# Altium project PCB_tesis.PrjPcb
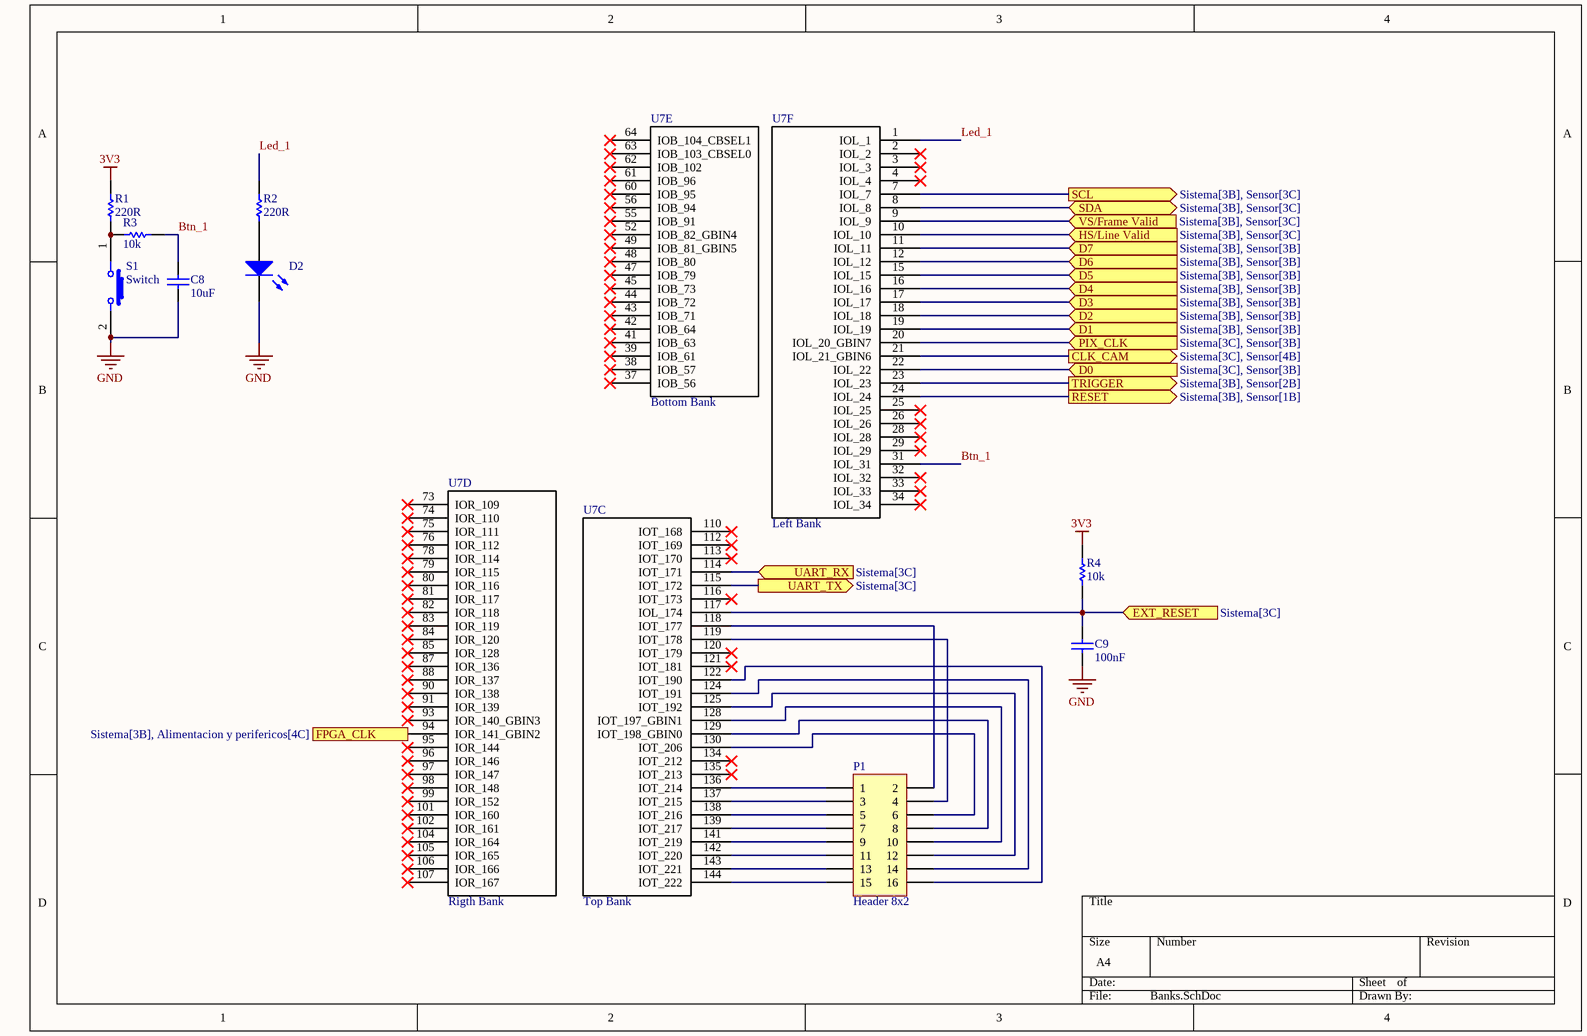
[diagram p0: Banks.SchDoc]
3 sheets, 42 parts. Net scope: flat (ports and power ports of the same name join across sheets).
Board file: Sistema.PcbDoc
Sheets:
  Banks.SchDoc
  Sensor.SchDoc
  Power.SchDoc

## Sheet Banks.SchDoc
size A4; SheetNumber: 3; SheetTotal: 5

### Parts
C8  10uF  [C_1206_3216_A]
C9  100nF  [C_0805_2013_b]
D2  GREEN  [D_LED_0805_2013]  (value not drawn)
P1  Header 8x2  [P_HDR2X8_3D]
R1  220R  [R_0805_2012_a]
R2  220R  [R_0805_2012_a]
R3  10k  [R_0805_2012_a]
R4  10k  [R_0805_2012_a]
S1  Switch  [S_SMD_SPST-NO]
U7  Top Bank  [U_TQFP-144]  (parts C,D,E,F of 9)

### Ports
CLK_CAM (out, see Sistema[3C], Sensor[4B]), D0 (in, see Sistema[3C], Sensor[3B]), D1 (in, see Sistema[3B], Sensor[3B]), D2 (in, see Sistema[3B], Sensor[3B]), D3 (in, see Sistema[3B], Sensor[3B]), D4 (in, see Sistema[3B], Sensor[3B]), D5 (in, see Sistema[3B], Sensor[3B]), D6 (in, see Sistema[3B], Sensor[3B]), D7 (in, see Sistema[3B], Sensor[3B]), EXT_RESET (in, see Sistema[3C]), FPGA_CLK (in, see Sistema[3B], Alimentacion y perifericos[4C]), HS/Line Valid (in, see Sistema[3B], Sensor[3C]), PIX_CLK (in, see Sistema[3C], Sensor[3B]), RESET (out, see Sistema[3B], Sensor[1B]), SCL (out, see Sistema[3B], Sensor[3C]), SDA (bidir, see Sistema[3B], Sensor[3C]), TRIGGER (out, see Sistema[3B], Sensor[2B]), UART_RX (in, see Sistema[3C]), UART_TX (out, see Sistema[3C]), VS/Frame Valid (in, see Sistema[3B], Sensor[3C])

### Nets
3V3: R1.2 R4.2
GND: C8.1 C9.1 D2.1(K) S1.2
Btn_1: C8.2 R3.2 U7.31(IOL_31)
Led_1: R2.2 U7.1(IOL_1)
NetC9_2: C9.2 R4.1 U7.117(IOL_174) ; port EXT_RESET
NetC45_2: U7.24(IOL_24) ; port RESET
NetD2_2: D2.2(A) R2.1
NetP1_1: P1.1 U7.136(IOT_214)
NetP1_2: P1.2 U7.118(IOT_177)
NetP1_3: P1.3 U7.137(IOT_215)
NetP1_4: P1.4 U7.119(IOT_178)
NetP1_5: P1.5 U7.138(IOT_216)
NetP1_6: P1.6 U7.130(IOT_206)
NetP1_7: P1.7 U7.139(IOT_217)
NetP1_8: P1.8 U7.129(IOT_198_GBIN0)
NetP1_9: P1.9 U7.141(IOT_219)
NetP1_10: P1.10 U7.128(IOT_197_GBIN1)
NetP1_11: P1.11 U7.142(IOT_220)
NetP1_12: P1.12 U7.125(IOT_192)
NetP1_13: P1.13 U7.143(IOT_221)
NetP1_14: P1.14 U7.124(IOT_191)
NetP1_15: P1.15 U7.144(IOT_222)
NetP1_16: P1.16 U7.122(IOT_190)
NetR1_1: R1.1 R3.1 S1.1
NetR13_2: U7.21(IOL_21_GBIN6) ; port CLK_CAM
NetR16_1: U7.7(IOL_7) ; port SCL
NetR17_1: U7.8(IOL_8) ; port SDA
NetU7_9: U7.9(IOL_9) ; port VS/Frame Valid
NetU7_10: U7.10(IOL_10) ; port HS/Line Valid
NetU7_11: U7.11(IOL_11) ; port D7
NetU7_12: U7.12(IOL_12) ; port D6
NetU7_15: U7.15(IOL_15) ; port D5
NetU7_16: U7.16(IOL_16) ; port D4
NetU7_17: U7.17(IOL_17) ; port D3
NetU7_18: U7.18(IOL_18) ; port D2
NetU7_19: U7.19(IOL_19) ; port D1
NetU7_20: U7.20(IOL_20_GBIN7) ; port PIX_CLK
NetU7_22: U7.22(IOL_22) ; port D0
NetU7_23: U7.23(IOL_23) ; port TRIGGER
NetU7_94: U7.94(IOR_141_GBIN2) ; port FPGA_CLK
NetU7_114: U7.114(IOT_171) ; port UART_RX
NetU7_115: U7.115(IOT_172) ; port UART_TX

Not connected (* = marked no-connect by the designer): U7 2(IOL_2)* 3(IOL_3)* 4(IOL_4)* 25(IOL_25)* 26(IOL_26)* 28(IOL_28)* 29(IOL_29)* 32(IOL_32)* 33(IOL_33)* 34(IOL_34)* 37(IOB_56)* 38(IOB_57)* 39(IOB_61)* 41(IOB_63)* 42(IOB_64)* 43(IOB_71)* 44(IOB_72)* 45(IOB_73)* 47(IOB_79)* 48(IOB_80)* 49(IOB_81_GBIN5)* 52(IOB_82_GBIN4)* 55(IOB_91)* 56(IOB_94)* 60(IOB_95)* 61(IOB_96)* 62(IOB_102)* 63(IOB_103_CBSEL0)* 64(IOB_104_CBSEL1)* 73(IOR_109)* 74(IOR_110)* 75(IOR_111)* 76(IOR_112)* 78(IOR_114)* 79(IOR_115)* 80(IOR_116)* 81(IOR_117)* 82(IOR_118)* 83(IOR_119)* 84(IOR_120)* 85(IOR_128)* 87(IOR_136)* 88(IOR_137)* 90(IOR_138)* 91(IOR_139)* 93(IOR_140_GBIN3)* 95(IOR_144)* 96(IOR_146)* 97(IOR_147)* 98(IOR_148)* 99(IOR_152)* 101(IOR_160)* 102(IOR_161)* 104(IOR_164)* 105(IOR_165)* 106(IOR_166)* 107(IOR_167)* 110(IOT_168)* 112(IOT_169)* 113(IOT_170)* 116(IOT_173)* 120(IOT_179)* 121(IOT_181)* 134(IOT_212)* 135(IOT_213)*

### Library data of the parts
C8 = C_10uF_25V_c: Capacitor SMD 1206; Manufacturer: Samsung; Manufacturer Part Number: CL31B106KAHNFNE; Tolerance: 10%; Voltage Rating: 25V; Dielectric: X7R; Mounting Technology: Surface Mount; Case/Package: 1206; Case Code (Metric): 3216; Case Code (Imperial): 1206; Min Operating Temperature: -55°C; Max Operating Temperature: 125°C; Packaging: Tape and Reel; Series: CL; Construction: Flat; Length: 3.2mm; Height: 1.6mm; Depth: 1.6mm; Radiation Hardening: No; Lead Free: Lead Free; RoHS Compliant: Yes; ComponentLink1URL: https://datasheet.ciiva.com/25795/cl31b106kahnfne-25795136.pdf?src-supplier=Digikey; ComponentLink1Description: https://datasheet.ciiva.com/25795/cl31b106kahnfne-25795136.pdf?src-supplier=Digikey; Supplier 1: Digikey; Supplier Part Number 1: 1276-3100-1-ND; RoHS: Yes; Category: Ceramic Capacitors; Stock 1: 466532; Pricing 1: 1=0,23, 10=0,149, 50=0,094, 100=0,0752, 500=0,0543, 1000=0,04804 (USD); Value: 10uF
C9 = C_100nF_50V_b: Capacitor SMD 0805; Manufacturer: Yageo; Manufacturer Part Number: CC0805KRX7R9BB104; Material: Ceramic; Tolerance: 10%; Dielectric: X7R; Voltage: 50V; Insulation Resistance: 100GR; Mounting Technology: Surface Mount; Case/Package: 0805; Pins: 2; Case Code (Metric): 2012; Case Code (Imperial): 0805; Min Operating Temperature: -55°C; Max Operating Temperature: 125°C; Packaging: Tape and Reel; Voltage Rating: 50V; Package Quantity: 4000; Termination: SMD/SMT; Series: CC; Length: 2mm; Height: 0.85mm; Depth: 1.25mm; Radiation Hardening: No; RoHS Compliant: Yes; Reach SVHC Compliant: No; Halogen Free: 5694HalogenFree; Lead Free: 5697LeadFree; ComponentLink1URL: https://datasheet.ciiva.com/11786/0900766b80d84f1d-11786009.pdf?src-supplier=Rs; ComponentLink1Description: https://datasheet.ciiva.com/11786/0900766b80d84f1d-11786009.pdf?src-supplier=Rs; ComponentLink2URL: https://datasheet.ciiva.com/46393/1734573-46393307.pdf?src-supplier=Element14; ComponentLink2Description: https://datasheet.ciiva.com/46393/1734573-46393307.pdf?src-supplier=Element14; ComponentLink3URL: https://datasheet.ciiva.com/155/mlccorderingcode-155930.pdf?src-supplier=Digikey; ComponentLink3Description: https://datasheet.ciiva.com/155/mlccorderingcode-155930.pdf?src-supplier=Digikey; ComponentLink4URL: https://datasheet.ciiva.com/155/mlccorderingcode-155929.pdf?src-supplier=Digikey; ComponentLink4Description: https://datasheet.ciiva.com/155/mlccorderingcode-155929.pdf?src-supplier=Digikey; ComponentLink5URL: https://datasheet.ciiva.com/155/mlccorderingcode-155931.pdf?src-supplier=Digikey; ComponentLink5Description: https://datasheet.ciiva.com/155/mlccorderingcode-155931.pdf?src-supplier=Digikey; ComponentLink6URL: https://datasheet.ciiva.com/11464/upy-gphc-x7r-6-3v-to-50v-8-11464757.pdf?src-supplier=Avnet; ComponentLink6Description: https://datasheet.ciiva.com/11464/upy-gphc-x7r-6-3v-to-50v-8-11464757.pdf?src-supplier=Avnet; ComponentLink7URL: https://datasheet.ciiva.com/28450/1489800-28450805.pdf?src-supplier=Element14; ComponentLink7Description: https://datasheet.ciiva.com/28450/1489800-28450805.pdf?src-supplier=Element14; ComponentLink8URL: https://datasheet.ciiva.com/29242/445210-da-01-en-kerko-chip-0805-x7r-0-1uf-10proz-50vg-29242074.pdf?src-supplier=Conrad; ComponentLink8Description: https://datasheet.ciiva.com/29242/445210-da-01-en-kerko-chip-0805-x7r-0-1uf-10proz-50vg-29242074.pdf?src-supplier=Conrad; Supplier 1: Digikey; Supplier Part Number 1: 311-1140-1-ND; RoHS: Yes; Category: Ceramic Capacitors; Stock 1: 5306374; Pricing 1: 1=0,1, 10=0,07, 50=0,0418, 100=0,0329, 500=0,02428, 1000=0,0201 (USD); Value: 100nF
D2 = D_LED_SMD_0805: (Modificar) Diode SMD 0805; Value: GREEN
P1 = P_Conector 8x2: Value: Header 8x2
R1 R2 = R_220R_b: Resistor SMD 0805; Manufacturer: Bourns; Manufacturer Part Number: CR0805-FX-2200ELF; Tolerance: 1%; Power Rating: 125mW; Voltage Rating: 150V; Temperature Coefficient: 100ppm/°C; Mounting Technology: Surface Mount; Case/Package: 0805; Case Code (Metric): 2012; Case Code (Imperial): 0805; Contact Plating: Tin; Min Operating Temperature: -55°C; Max Operating Temperature: 155°C; Package Quantity: 5000; Packaging: Tape and Reel; Number of Terminations: 2; Termination: SMD/SMT; Max Power Dissipation: 125mW; Features: Moisture Resistant; Series: CR0805; Length: 2mm; Width: 1.25mm; Height: 0.5mm; Thickness: 508um; Radiation Hardening: No; RoHS Compliant: Yes; ComponentLink1URL: https://datasheet.ciiva.com/5540/chpreztr-5540846.pdf?src-supplier=Mouser; ComponentLink1Description: https://datasheet.ciiva.com/5540/chpreztr-5540846.pdf?src-supplier=Mouser; Supplier 1: Digikey; Supplier Part Number 1: CR0805-FX-2200ELFCT-ND; RoHS: Yes; Category: Chip SMD Resistors; Stock 1: 162372; Pricing 1: 1=0,1, 10=0,021, 50=0,0132, 100=0,011, 500=0,00744, 1000=0,00639 (USD); Value: 220R
R3 R4 = R_10k_b: Resistor SMD 0805; Manufacturer: Yageo; Manufacturer Part Number: AC0805FR-0710KL; Tolerance: 1%; Power Rating: 125mW; Voltage Rating: 150V; Temperature Coefficient: 100ppm/°C; Case/Package: 0805; Case Code (Metric): 2012; Case Code (Imperial): 0805; Min Operating Temperature: -55°C; Max Operating Temperature: 155°C; Packaging: Tape and Reel; Package Quantity: 1; Number of Terminations: 2; Termination: SMD/SMT; Max Power Dissipation: 125mW; Features: Moisture Resistant,Automotive AEC-Q200,Anti-Sulfur; Series: AC; Construction: Rectangular; Length: 0.079inch; Width: 0.049inch; Height: 0.024inch; Depth: 1.25mm; Military Standard: Not; Lead Free: Lead Free; RoHS Compliant: Yes; ComponentLink1URL: http://www.yageo.com/NewPortal/yageodocoutput?fileName=/pdf/R-Chip/PYu-AC_51_RoHS_L_6.pdf&src-supplier=Digikey; ComponentLink1Description: http://www.yageo.com/NewPortal/yageodocoutput?fileName=/pdf/R-Chip/PYu-AC_51_RoHS_L_6.pdf&src-supplier=Digikey; ComponentLink2URL: http://www.yageo.com/documents/recent/PYu-AC_51_RoHS_L_2_revised.pdf?src-supplier=Future+Electronics; ComponentLink2Description: http://www.yageo.com/documents/recent/PYu-AC_51_RoHS_L_2_revised.pdf?src-supplier=Future+Electronics; ComponentLink3URL: http://www.yageo.com/NewPortal/yageodocoutput?fileName=/pdf/R-Chip/PYu-AC_51_RoHS_L_6.pdf&src-supplier=NAC+Semi; ComponentLink3Description: http://www.yageo.com/NewPortal/yageodocoutput?fileName=/pdf/R-Chip/PYu-AC_51_RoHS_L_6.pdf&src-supplier=NAC+Semi; ComponentLink4URL: http://www.yageo.com/NewPortal/yageodocoutput?fileName=/pdf/R-Chip/PYu-AC_51_RoHS_L_6.pdf&src-supplier=Rutronik; ComponentLink4Description: http://www.yageo.com/NewPortal/yageodocoutput?fileName=/pdf/R-Chip/PYu-AC_51_RoHS_L_6.pdf&src-supplier=Rutronik; Supplier 1: Digikey; Supplier Part Number 1: 311-10KLGCT-ND; RoHS: Yes; Category: Chip SMD Resistors; Stock 1: 480247; Pricing 1: 1=0,1, 10=0,031, 50=0,0198, 100=0,0166, 500=0,01152, 1000=0,00997 (USD); Value: 10k
S1 = S_?_3: (Generico) Switch SMD; Value: Switch
U7 = U_iCE40HX4K: Supplier 1: Digikey; Supplier Part Number 1: 220-1572-ND

## Sheet Sensor.SchDoc
size A4; SheetNumber: 5; SheetTotal: 5
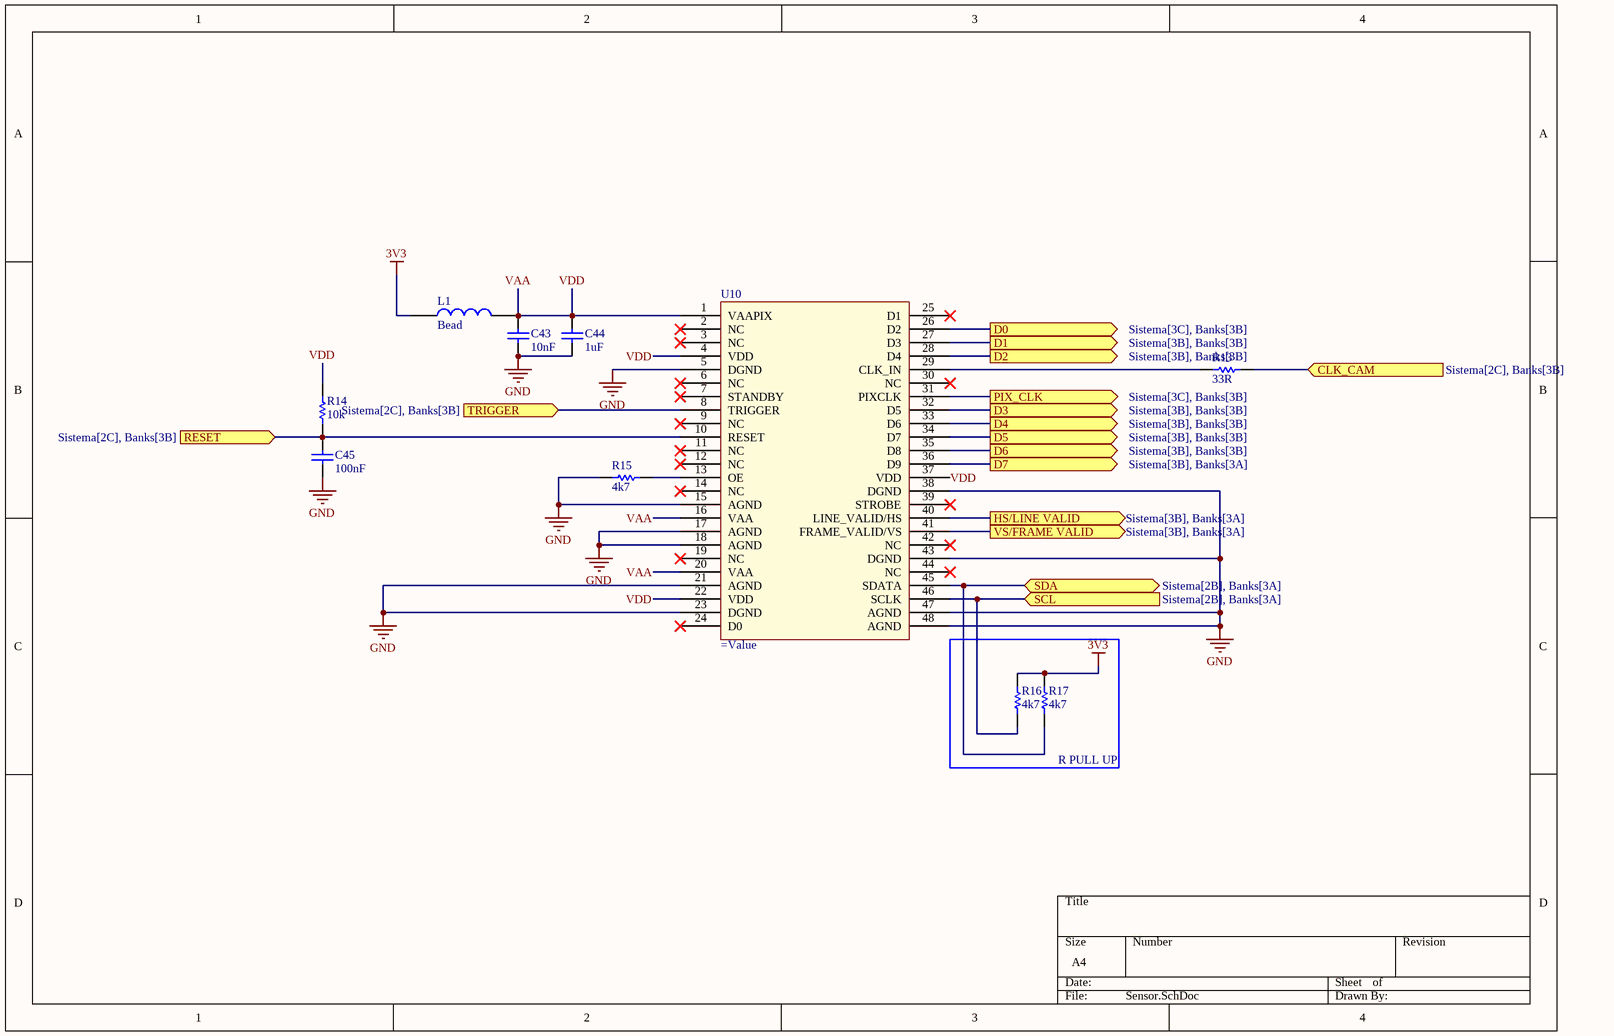
[diagram p1: Sensor.SchDoc]

### Parts
C43  10nF  [C_0805_2013_b]
C44  1uF  [C_0805_2013_b]
C45  100nF  [C_0805_2013_b]
L1  Bead  [L_0805_2013]
R13  33R  [R_0805_2012_a]
R14  10k  [R_0805_2012_a]
R15  4k7  [R_0805_2012_a]
R16  4k7  [R_0805_2012_a]
R17  4k7  [R_0805_2012_a]
U10  (no value)  [U_CLCC48_SOCKET]

### Blocks framed on the sheet
R PULL UP: R16 R17

### Ports
CLK_CAM (in, see Sistema[2C], Banks[3B]), D0 (out, see Sistema[3C], Banks[3B]), D1 (out, see Sistema[3B], Banks[3B]), D2 (out, see Sistema[3B], Banks[3B]), D3 (out, see Sistema[3B], Banks[3B]), D4 (out, see Sistema[3B], Banks[3B]), D5 (out, see Sistema[3B], Banks[3B]), D6 (out, see Sistema[3B], Banks[3B]), D7 (out, see Sistema[3B], Banks[3A]), HS/LINE VALID (out, see Sistema[3B], Banks[3A]), PIX_CLK (out, see Sistema[3C], Banks[3B]), RESET (in, see Sistema[2C], Banks[3B]), SCL (in, see Sistema[2B], Banks[3A]), SDA (bidir, see Sistema[2B], Banks[3A]), TRIGGER (in, see Sistema[2C], Banks[3B]), VS/FRAME VALID (out, see Sistema[3B], Banks[3A])

### Nets
3V3: L1.1 R16.2 R17.2
GND: C43.1 C44.1 C45.1 R15.1 U10.5(DGND) U10.15(AGND) U10.17(AGND) U10.18(AGND) U10.21(AGND) U10.23(DGND) U10.38(DGND) U10.43(DGND) U10.47(AGND) U10.48(AGND)
VAA: C43.2 C44.2 L1.2 R14.2 U10.1(VAAPIX) U10.4(VDD) U10.16(VAA) U10.20(VAA) U10.22(VDD) U10.37(VDD)  [also labelled VDD]
NetC45_2: C45.2 R14.1 U10.10(RESET) ; port RESET
NetR13_1: R13.1 U10.29(CLK_IN)
NetR13_2: R13.2 ; port CLK_CAM
NetR15_2: R15.2 U10.13(OE)
NetR16_1: R16.1 U10.46(SCLK) ; port SCL
NetR17_1: R17.1 U10.45(SDATA) ; port SDA
NetU7_9: U10.41(FRAME_VALID/VS) ; port VS/FRAME VALID
NetU7_10: U10.40(LINE_VALID/HS) ; port HS/LINE VALID
NetU7_11: U10.36(D9) ; port D7
NetU7_12: U10.35(D8) ; port D6
NetU7_15: U10.34(D7) ; port D5
NetU7_16: U10.33(D6) ; port D4
NetU7_17: U10.32(D5) ; port D3
NetU7_18: U10.28(D4) ; port D2
NetU7_19: U10.27(D3) ; port D1
NetU7_20: U10.31(PIXCLK) ; port PIX_CLK
NetU7_22: U10.26(D2) ; port D0
NetU7_23: U10.8(TRIGGER) ; port TRIGGER

Not connected (* = marked no-connect by the designer): U10 2(NC)* 3(NC)* 6(NC)* 7(STANDBY)* 9(NC)* 11(NC)* 12(NC)* 14(NC)* 19(NC)* 24(D0)* 25(D1)* 30(NC)* 39(STROBE)* 42(NC)* 44(NC)*

### Library data of the parts
C43 = C_10nF_50V_b: Capacitor SMD 0805; Manufacturer: KEMET; Manufacturer Part Number: C0805C103J5RAC7210; Dielectric Material: Ceramic; Tolerance: 5%; Voltage Rating: 50V; Dielectric: X7R; Case/Package: 0805; Case Code (Imperial): 0805; Case Code (Metric): 2012; Min Operating Temperature: -55°C; Max Operating Temperature: 125°C; Packaging: Tape and Reel; Package Quantity: 10000; Voltage Rating (DC): 50V; Termination: SMD/SMT; Series: SMD Comm X7R; Length: 2mm; Lead Pitch: 0.75mm; Depth: 1.25mm; RoHS Compliant: Yes; ComponentLink1URL: http://www.mouser.com/ds/2/212/KEM_C1002_X7R_SMD-1102033.pdf?src-supplier=Mouser; ComponentLink1Description: http://www.mouser.com/ds/2/212/KEM_C1002_X7R_SMD-1102033.pdf?src-supplier=Mouser; ComponentLink2URL: http://components.arrow.com/part/dataview/3450688S9650973N7429?src-supplier=Arrow+Electronics; ComponentLink2Description: http://components.arrow.com/part/dataview/3450688S9650973N7429?src-supplier=Arrow+Electronics; ComponentLink3URL: https://datasheet.octopart.com/C0805C103J5RAC7210-KEMET-datasheet-68331906.pdf?src-supplier=Farnell; ComponentLink3Description: https://datasheet.octopart.com/C0805C103J5RAC7210-KEMET-datasheet-68331906.pdf?src-supplier=Farnell; ComponentLink4URL: https://api.kemet.com/component-edge/download/datasheet/C0805C103J5RAC7210.pdf?src-supplier=Digikey; ComponentLink4Description: https://api.kemet.com/component-edge/download/datasheet/C0805C103J5RAC7210.pdf?src-supplier=Digikey; ComponentLink5URL: https://datasheet.octopart.com/C0805C103J5RAC7210-KEMET-datasheet-37550250.pdf?src-supplier=Electro+Sonic; ComponentLink5Description: https://datasheet.octopart.com/C0805C103J5RAC7210-KEMET-datasheet-37550250.pdf?src-supplier=Electro+Sonic; ComponentLink6URL: https://datasheet.octopart.com/C0805C103J5RAC7210-KEMET-datasheet-166547538.pdf?src-supplier=TME; ComponentLink6Description: https://datasheet.octopart.com/C0805C103J5RAC7210-KEMET-datasheet-166547538.pdf?src-supplier=TME; Supplier 1: Mouser; Supplier Part Number 1: 80-C0805C103J5R7210; RoHS: Yes; Category: Ceramic Capacitors; Stock 1: 30128; Pricing 1: 1=0,1, 10=0,034, 50=0,034, 100=0,02, 1000=0,014, 10000=0,009 (USD); Value: 10nF
C44 = C_1uF_50V_b: Capacitor SMD 0805; Manufacturer: Cal-Chip Electronics; Manufacturer Part Number: GMC21X7R105K50NT; Supplier 1: Digikey; Supplier Part Number 1: 4713-GMC21X7R105K50NTCT-ND; RoHS: Yes; Category: Ceramic Capacitors; Stock 1: 1410; Pricing 1: 1=0,16, 10=0,106, 50=0,0632, 100=0,0497, 500=0,03672, 1000=0,0304 (USD); Value: 1uF; JLCPCB Part #: C17287262
C45 = C_100nF_50V_b: as C9 on sheet Banks; Mounting Technology: Surface Mount; Case/Package: 0805; Pins: 2; Case Code (Metric): 2012; Case Code (Imperial): 0805; Min Operating Temperature: -55°C; Max Operating Temperature: 125°C; Packaging: Tape and Reel; Voltage Rating: 50V; Package Quantity: 4000; Termination: SMD/SMT; Series: CC; Length: 2mm; Height: 0.85mm; Depth: 1.25mm; Radiation Hardening: No; RoHS Compliant: Yes; Reach SVHC Compliant: No; Halogen Free: 5694HalogenFree; Lead Free: 5697LeadFree; ComponentLink1URL: https://datasheet.ciiva.com/11786/0900766b80d84f1d-11786009.pdf?src-supplier=Rs; ComponentLink1Description: https://datasheet.ciiva.com/11786/0900766b80d84f1d-11786009.pdf?src-supplier=Rs; ComponentLink2URL: https://datasheet.ciiva.com/46393/1734573-46393307.pdf?src-supplier=Element14; ComponentLink2Description: https://datasheet.ciiva.com/46393/1734573-46393307.pdf?src-supplier=Element14; ComponentLink3URL: https://datasheet.ciiva.com/155/mlccorderingcode-155930.pdf?src-supplier=Digikey; ComponentLink3Description: https://datasheet.ciiva.com/155/mlccorderingcode-155930.pdf?src-supplier=Digikey; ComponentLink4URL: https://datasheet.ciiva.com/155/mlccorderingcode-155929.pdf?src-supplier=Digikey; ComponentLink4Description: https://datasheet.ciiva.com/155/mlccorderingcode-155929.pdf?src-supplier=Digikey; ComponentLink5URL: https://datasheet.ciiva.com/155/mlccorderingcode-155931.pdf?src-supplier=Digikey; ComponentLink5Description: https://datasheet.ciiva.com/155/mlccorderingcode-155931.pdf?src-supplier=Digikey; ComponentLink6URL: https://datasheet.ciiva.com/11464/upy-gphc-x7r-6-3v-to-50v-8-11464757.pdf?src-supplier=Avnet; ComponentLink6Description: https://datasheet.ciiva.com/11464/upy-gphc-x7r-6-3v-to-50v-8-11464757.pdf?src-supplier=Avnet; ComponentLink7URL: https://datasheet.ciiva.com/28450/1489800-28450805.pdf?src-supplier=Element14; ComponentLink7Description: https://datasheet.ciiva.com/28450/1489800-28450805.pdf?src-supplier=Element14; ComponentLink8URL: https://datasheet.ciiva.com/29242/445210-da-01-en-kerko-chip-0805-x7r-0-1uf-10proz-50vg-29242074.pdf?src-supplier=Conrad; ComponentLink8Description: https://datasheet.ciiva.com/29242/445210-da-01-en-kerko-chip-0805-x7r-0-1uf-10proz-50vg-29242074.pdf?src-supplier=Conrad; Supplier 1: Digikey; Supplier Part Number 1: 311-1140-1-ND; RoHS: Yes; Category: Ceramic Capacitors; Stock 1: 5306374; Pricing 1: 1=0,1, 10=0,07, 50=0,0418, 100=0,0329, 500=0,02428, 1000=0,0201 (USD); Value: 100nF
L1 = L_Bead: Inductor SMD 0805; Manufacturer: Pulse; Manufacturer Part Number: PE-0805PFB600ST; Number of Lines: 1; Max Current Rating: 3A; Mounting Technology: Surface Mount; Case/Package: 0805; Case Code (Metric): 2012; Case Code (Imperial): 0805; Min Operating Temperature: -40°C; Max Operating Temperature: 105°C; Package Quantity: 4000; Packaging: Cut Tape; Series: PFB; Length: 0.079inch; Width: 0.049inch; Height: 0.041inch; RoHS Compliant: Yes; ComponentLink1URL: https://productfinder.pulseeng.com/doc_type/WEB301/doc_num/WC706/doc_part/WC706.pdf?src-supplier=Digikey; ComponentLink1Description: https://productfinder.pulseeng.com/doc_type/WEB301/doc_num/WC706/doc_part/WC706.pdf?src-supplier=Digikey; ComponentLink2URL: http://productfinder.pulseeng.com/products/datasheets/WC706.pdf?src-supplier=Digikey; ComponentLink2Description: http://productfinder.pulseeng.com/products/datasheets/WC706.pdf?src-supplier=Digikey; Supplier 1: Mouser; Supplier Part Number 1: 673-PE-0805PFB600ST; RoHS: Yes; Category: Ferrite Beads and Chips; Stock 1: 58506; Pricing 1: 1=0,1, 10=0,051, 50=0,051, 100=0,035, 1000=0,025, 10000=0,02 (USD); Value: Bead
R13 = R_33R_b: Resistor SMD 0805; Manufacturer: Stackpole Electronics; Manufacturer Part Number: RMCF0805FT33R0; Tolerance: 1%; Max Power Dissipation: 125mW; Temperature Coefficient: 100ppm/°C; Voltage Rating: 150V; Mounting Technology: Surface Mount; Case/Package: 0805; Case Code (Metric): 2012; Case Code (Imperial): 0805; Contact Plating: Tin,Matte; Min Operating Temperature: -55°C; Max Operating Temperature: 155°C; Packaging: Tape and Reel; Number of Terminations: 2; Features: Automotive AEC-Q200; Series: RMCF; Length: 0.079inch; Width: 0.049inch; Height: 0.026inch; Ratings: AEC-Q200; Radiation Hardening: No; RoHS Compliant: Yes; ComponentLink1URL: http://components.arrow.com/part/dataview/50498375S389572N1174?src-supplier=Arrow+Electronics; ComponentLink1Description: http://components.arrow.com/part/dataview/50498375S389572N1174?src-supplier=Arrow+Electronics; ComponentLink2URL: https://www.seielect.com/catalog/SEI-RMCF_RMCP.pdf?src-supplier=Avnet; ComponentLink2Description: https://www.seielect.com/catalog/SEI-RMCF_RMCP.pdf?src-supplier=Avnet; ComponentLink3URL: https://www.seielect.com/Catalog/SEI-RMCF_RMCP.pdf?src-supplier=Digikey; ComponentLink3Description: https://www.seielect.com/Catalog/SEI-RMCF_RMCP.pdf?src-supplier=Digikey; ComponentLink4URL: https://www.seielect.com/catalog/SEI-Packaging.pdf?src-supplier=Digikey; ComponentLink4Description: https://www.seielect.com/catalog/SEI-Packaging.pdf?src-supplier=Digikey; Supplier 1: Digikey; Supplier Part Number 1: RMCF0805FT33R0CT-ND; RoHS: Yes; Category: Chip SMD Resistors; Stock 1: 76142; Pricing 1: 1=0,1, 10=0,02, 50=0,0124, 100=0,0103, 500=0,007, 1000=0,00601 (USD); Value: 33R
R14 = R_10k_b: as R3 on sheet Banks; Case/Package: 0805; Case Code (Metric): 2012; Case Code (Imperial): 0805; Min Operating Temperature: -55°C; Max Operating Temperature: 155°C; Packaging: Tape and Reel; Package Quantity: 1; Number of Terminations: 2; Termination: SMD/SMT; Max Power Dissipation: 125mW; Features: Moisture Resistant,Automotive AEC-Q200,Anti-Sulfur; Series: AC; Construction: Rectangular; Length: 0.079inch; Width: 0.049inch; Height: 0.024inch; Depth: 1.25mm; Military Standard: Not; Lead Free: Lead Free; RoHS Compliant: Yes; ComponentLink1URL: http://www.yageo.com/NewPortal/yageodocoutput?fileName=/pdf/R-Chip/PYu-AC_51_RoHS_L_6.pdf&src-supplier=Digikey; ComponentLink1Description: http://www.yageo.com/NewPortal/yageodocoutput?fileName=/pdf/R-Chip/PYu-AC_51_RoHS_L_6.pdf&src-supplier=Digikey; ComponentLink2URL: http://www.yageo.com/documents/recent/PYu-AC_51_RoHS_L_2_revised.pdf?src-supplier=Future+Electronics; ComponentLink2Description: http://www.yageo.com/documents/recent/PYu-AC_51_RoHS_L_2_revised.pdf?src-supplier=Future+Electronics; ComponentLink3URL: http://www.yageo.com/NewPortal/yageodocoutput?fileName=/pdf/R-Chip/PYu-AC_51_RoHS_L_6.pdf&src-supplier=NAC+Semi; ComponentLink3Description: http://www.yageo.com/NewPortal/yageodocoutput?fileName=/pdf/R-Chip/PYu-AC_51_RoHS_L_6.pdf&src-supplier=NAC+Semi; ComponentLink4URL: http://www.yageo.com/NewPortal/yageodocoutput?fileName=/pdf/R-Chip/PYu-AC_51_RoHS_L_6.pdf&src-supplier=Rutronik; ComponentLink4Description: http://www.yageo.com/NewPortal/yageodocoutput?fileName=/pdf/R-Chip/PYu-AC_51_RoHS_L_6.pdf&src-supplier=Rutronik; Supplier 1: Digikey; Supplier Part Number 1: 311-10KLGCT-ND; RoHS: Yes; Category: Chip SMD Resistors; Stock 1: 480247; Pricing 1: 1=0,1, 10=0,031, 50=0,0198, 100=0,0166, 500=0,01152, 1000=0,00997 (USD); Value: 10k
R15-R17 = R_4k7_b: Resistor SMD 0805; Manufacturer: Stackpole Electronics; Manufacturer Part Number: RMCF0805FT4K70; Tolerance: 1%; Power Rating: 125mW; Temperature Coefficient: 100ppm/°C; Mounting Technology: Surface Mount; Case/Package: 0805; Case Code (Metric): 2012; Case Code (Imperial): 0805; Contact Plating: Tin,Matte; Min Operating Temperature: -55°C; Max Operating Temperature: 155°C; Packaging: Tape and Reel; Number of Terminations: 2; Max Power Dissipation: 125mW; Features: Automotive AEC-Q200; Series: RMCF; Construction: Rectangular; Length: 2mm; Width: 0.049inch; Height: 0.026inch; Depth: 1.25mm; Ratings: AEC-Q200; Radiation Hardening: No; Military Standard: Not; Lead Free: Lead Free; RoHS Compliant: Yes; ComponentLink1URL: https://www.seielect.com/catalog/SEI-RMCF_RMCP.pdf?src-supplier=Avnet; ComponentLink1Description: https://www.seielect.com/catalog/SEI-RMCF_RMCP.pdf?src-supplier=Avnet; ComponentLink2URL: https://www.seielect.com/Catalog/SEI-RMCF_RMCP.pdf?src-supplier=Digikey; ComponentLink2Description: https://www.seielect.com/Catalog/SEI-RMCF_RMCP.pdf?src-supplier=Digikey; ComponentLink3URL: https://www.seielect.com/catalog/SEI-Packaging.pdf?src-supplier=Digikey; ComponentLink3Description: https://www.seielect.com/catalog/SEI-Packaging.pdf?src-supplier=Digikey; ComponentLink4URL: http://components.arrow.com/part/dataview/44988207S7163511N1174?src-supplier=Arrow+Electronics; ComponentLink4Description: http://components.arrow.com/part/dataview/44988207S7163511N1174?src-supplier=Arrow+Electronics; ComponentLink5URL: http://www.seielect.com/catalog/sei-rmc.pdf?src-supplier=Future+Electronics; ComponentLink5Description: http://www.seielect.com/catalog/sei-rmc.pdf?src-supplier=Future+Electronics; ComponentLink6URL: https://datasheet.octopart.com/RMCF0805FT4K70-Stackpole-Electronics-datasheet-11547379.pdf?src-supplier=Future+Electronics; ComponentLink6Description: https://datasheet.octopart.com/RMCF0805FT4K70-Stackpole-Electronics-datasheet-11547379.pdf?src-supplier=Future+Electronics; ComponentLink7URL: https://www.verical.com/server-webapp/html/getDatasheet?partID=409513&src-supplier=Verical; ComponentLink7Description: https://www.verical.com/server-webapp/html/getDatasheet?partID=409513&src-supplier=Verical; Supplier 1: Digikey; Supplier Part Number 1: RMCF0805FT4K70CT-ND; RoHS: Yes; Category: Chip SMD Resistors; Stock 1: 619298; Pricing 1: 1=0,1, 10=0,02, 50=0,0124, 100=0,0103, 500=0,007, 1000=0,00601 (USD); Value: 4k7
U10 = MT9M001C12STM: SENSOR 1/2 PULGADA 1 MEGAPIXEL; Supplier 1: Newark; Supplier Part Number 1: 30AC9943; Supplier 2: Farnell; Supplier Part Number 2: 3613986; ComponentLink1Description: DATASHEET; ComponentLink1URL: https://github.com/Fresita-codificadora/Proyecto_Final_DOME/blob/main/datasheet/HOJA_DE_DATOS_IMAGER_mt9m001_USADO_CON_FPGA.pdf

## Sheet Power.SchDoc
size A4; SheetNumber: 5; SheetTotal: 5
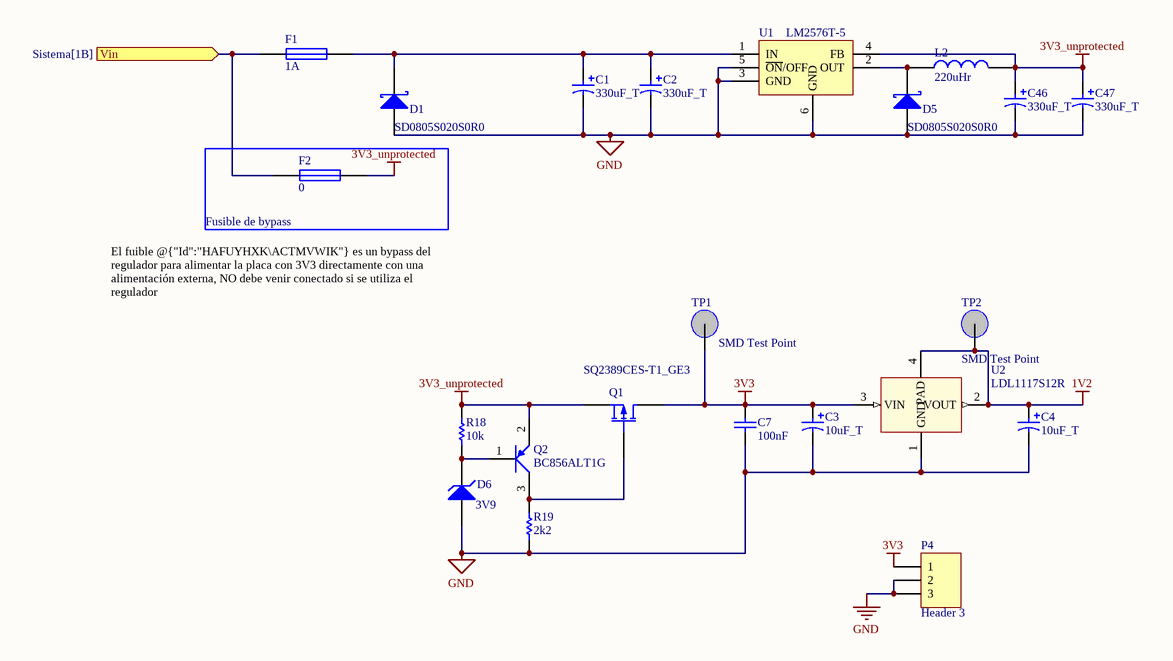
[diagram p2: Power.SchDoc]

### Parts
C1  330uF_T  [C_2917]
C2  330uF_T  [C_2917]
C3  10uF_T  [C_0805_2013_c]
C4  10uF_T  [C_0805_2013_c]
C7  100nF  [C_0805_2013_b]
C46  330uF_T  [C_2917]
C47  330uF_T  [C_2917]
D1  SD0805S020S0R0  [D_SOD-123]
D5  SD0805S020S0R0  [D_SOD-123]
D6  3V9  [D_SOD-123]
F1  1A  [F_0805_2012]
F2  0  [F_0805_2012]
L2  220uHr  [L_SMD_10x10]
P4  Header 3  [P_HDR1X3_3D]
Q1  SQ2389CES-T1_GE3  [Q_SOT-23]
Q2  BC856ALT1G  [Q_SOT-23B_N]
R18  10k  [R_0805_2012_a]
R19  2k2  [R_0805_2012_a]
TP1  SMD Test Point  [TP SMD]
TP2  SMD Test Point  [TP SMD]
U1  LM2576T-5  [U_SMD_TO-263-5]
U2  LDL1117S12R  [U_SOT-223]

### Blocks framed on the sheet
Fusible de bypass: F2

### Ports
Vin (in, see Sistema[1B])

### Nets
1V2: C4.1 TP2.1 U2.2(VOUT) U2.4(PAD)
3V3: C3.1 C7.2 P4.1 Q1.3(D) TP1.1 U2.3(VIN)
3V3_unprotected: C46.1 C47.1 F2.2 L2.2 Q1.2(S) Q2.2(E) R18.2 U1.4(FB)
GND: C1.2 C2.2 C3.2 C4.2 C7.1 C46.2 C47.2 D1.2(A) D5.2(A) D6.2(A) P4.2 P4.3 R19.2 U1.3(GND) U1.5(~{O}~{N}/OFF) U1.6(GND) U2.1(GND)
NetC1_1: C1.1 C2.1 D1.1(K) F1.2 U1.1(IN)
NetD5_1: D5.1(K) L2.1 U1.2(OUT)
NetD6_1: D6.1(K) Q2.1(B) R18.1
NetF1_1: F1.1 F2.1 ; port Vin
NetQ1_1: Q1.1(G) Q2.3(C) R19.1

### Notes on the sheet
- El fuible @{"Id":"HAFUYHXK\ACTMVWIK"} es un bypass del regulador para alimentar la placa con 3V3 directamente con una alimentación externa, NO debe venir conectado si se utiliza el regulador

### Library data of the parts
C1 = C_330uF_tant_16V: Capacitor SMD 2917 Tant,TPME337*016#0050; Manufacturer: Vishay; Manufacturer Part Number: TMCP1A106MTRF; RoHS Compliant: Yes; RoHS: Yes; Category: Tantalum Capacitors; Stock 1: 7293; Pricing 1: 1=0,3, 10=0,152, 50=0,152, 100=0,098, 1000=0,082, 10000=0,067 (USD); Value: 330uF_T; Supplier 1: Mouser; Supplier Part Number 1: 581-TPME337K016R0050
C2 C46 C47 = C_330uF_tant_16V: Capacitor SMD 2917 Tant; Manufacturer: Vishay; Manufacturer Part Number: TMCP1A106MTRF; RoHS Compliant: Yes; RoHS: Yes; Category: Tantalum Capacitors; Stock 1: 7293; Pricing 1: 1=0,3, 10=0,152, 50=0,152, 100=0,098, 1000=0,082, 10000=0,067 (USD); Value: 330uF_T; Supplier 1: Mouser; Supplier Part Number 1: 581-TPME337K016R0050
C3 C4 = C_10uF_10V_b: Capacitor SMD 0805 Tant; Manufacturer: Vishay; Manufacturer Part Number: TMCP1A106MTRF; RoHS Compliant: Yes; Supplier 1: Mouser; Supplier Part Number 1: 74-TMCP1A106MTRF; RoHS: Yes; Category: Tantalum Capacitors; Stock 1: 7293; Pricing 1: 1=0,3, 10=0,152, 50=0,152, 100=0,098, 1000=0,082, 10000=0,067 (USD); Value: 10uF_T
C7 = C_100nF_50V_b: as C9 on sheet Banks; Mounting Technology: Surface Mount; Case/Package: 0805; Pins: 2; Case Code (Metric): 2012; Case Code (Imperial): 0805; Min Operating Temperature: -55°C; Max Operating Temperature: 125°C; Packaging: Tape and Reel; Voltage Rating: 50V; Package Quantity: 4000; Termination: SMD/SMT; Series: CC; Length: 2mm; Height: 0.85mm; Depth: 1.25mm; Radiation Hardening: No; RoHS Compliant: Yes; Reach SVHC Compliant: No; Halogen Free: 5694HalogenFree; Lead Free: 5697LeadFree; ComponentLink1URL: https://datasheet.ciiva.com/11786/0900766b80d84f1d-11786009.pdf?src-supplier=Rs; ComponentLink1Description: https://datasheet.ciiva.com/11786/0900766b80d84f1d-11786009.pdf?src-supplier=Rs; ComponentLink2URL: https://datasheet.ciiva.com/46393/1734573-46393307.pdf?src-supplier=Element14; ComponentLink2Description: https://datasheet.ciiva.com/46393/1734573-46393307.pdf?src-supplier=Element14; ComponentLink3URL: https://datasheet.ciiva.com/155/mlccorderingcode-155930.pdf?src-supplier=Digikey; ComponentLink3Description: https://datasheet.ciiva.com/155/mlccorderingcode-155930.pdf?src-supplier=Digikey; ComponentLink4URL: https://datasheet.ciiva.com/155/mlccorderingcode-155929.pdf?src-supplier=Digikey; ComponentLink4Description: https://datasheet.ciiva.com/155/mlccorderingcode-155929.pdf?src-supplier=Digikey; ComponentLink5URL: https://datasheet.ciiva.com/155/mlccorderingcode-155931.pdf?src-supplier=Digikey; ComponentLink5Description: https://datasheet.ciiva.com/155/mlccorderingcode-155931.pdf?src-supplier=Digikey; ComponentLink6URL: https://datasheet.ciiva.com/11464/upy-gphc-x7r-6-3v-to-50v-8-11464757.pdf?src-supplier=Avnet; ComponentLink6Description: https://datasheet.ciiva.com/11464/upy-gphc-x7r-6-3v-to-50v-8-11464757.pdf?src-supplier=Avnet; ComponentLink7URL: https://datasheet.ciiva.com/28450/1489800-28450805.pdf?src-supplier=Element14; ComponentLink7Description: https://datasheet.ciiva.com/28450/1489800-28450805.pdf?src-supplier=Element14; ComponentLink8URL: https://datasheet.ciiva.com/29242/445210-da-01-en-kerko-chip-0805-x7r-0-1uf-10proz-50vg-29242074.pdf?src-supplier=Conrad; ComponentLink8Description: https://datasheet.ciiva.com/29242/445210-da-01-en-kerko-chip-0805-x7r-0-1uf-10proz-50vg-29242074.pdf?src-supplier=Conrad; Supplier 1: Digikey; Supplier Part Number 1: 311-1140-1-ND; RoHS: Yes; Category: Ceramic Capacitors; Stock 1: 5306374; Pricing 1: 1=0,1, 10=0,07, 50=0,0418, 100=0,0329, 500=0,02428, 1000=0,0201 (USD); Value: 100nF
D1 D5 = D_SD0805S020S0R5: Diode SMD D_SD0805S020S0R5; Manufacturer: Diodes; Manufacturer Part Number: B550C-13-F; Max Reverse Current: 500uA; Forward Current: 5A; Max Repetitive Reverse Voltage (Vrrm): 50V; Peak Non-Repetitive Surge Current: 100A; Polarity: Standard; Forward Voltage: 700mV; Mounting Technology: Surface Mount; Case/Package: SMC; Pins: 2; Weight: 0.007408oz; Contact Plating: Tin,Matte; Min Operating Temperature: -55°C; Max Operating Temperature: 125°C; Package Quantity: 3000; Packaging: Tape and Reel; Current Rating: 5A; Output Current: 5A; Series: -; Average Rectified Current: 5A; Max Forward Surge Current (Ifsm): 100A; Termination: SMD/SMT; Voltage Rating (DC): 50V; Max Reverse Voltage (DC): 50V; Length: 7.11mm; Width: 6.22mm; Height: 2.5mm; Radiation Hardening: No; Lead Free: Lead Free; RoHS Compliant: Yes; Reach SVHC Compliant: No; RoHS: Yes; Category: Rectifier Diodes; Stock 1: 65197; Pricing 1: 1=0,56, 10=0,476, 100=0,3309, 500=0,25834, 1000=0,20998 (USD); Value: SD0805S020S0R0; Supplier 1: Digikey; Supplier Part Number 1: 478-7799-1-ND
D6 = D_DDZ5V1B-7: Zener Diode; Manufacturer: Diodes; Max Power Dissipation: 500mW; Zener Voltage: 5.1V; Max Reverse Leakage Current: 5uA; Tolerance: 3%; Forward Voltage: 900mV; Impedance: 17R; Test Current: 20mA; Output Current: 40mA; Mounting Technology: Surface Mount; Case/Package: SOD-123-2; Pins: 2; Weight: 0.000353oz; Min Operating Temperature: -65°C; Max Operating Temperature: 150°C; Package Quantity: 3000; Packaging: Tape and Reel; Voltage Tolerance: 3%; Power Rating: 500mW; Series: -; Zener Current: 5uA; Max Reverse Current: 5uA; Power Dissipation: 500mW; Working Voltage: 5.1V; Termination: SMD/SMT; Voltage Rating (DC): 5.1V; Length: 3.85mm; Width: 1.7mm; Height: 1.35mm; Radiation Hardening: No; RoHS Compliant: Yes; Lead Free: Lead Free; ComponentLink1URL: http://components.arrow.com/part/dataview/41508659S7354897N2868?src-supplier=Arrow+Electronics; ComponentLink1Description: http://components.arrow.com/part/dataview/41508659S7354897N2868?src-supplier=Arrow+Electronics; ComponentLink2URL: http://www.mouser.com/ds/2/115/ds30407-71565.pdf?src-supplier=Mouser; ComponentLink2Description: http://www.mouser.com/ds/2/115/ds30407-71565.pdf?src-supplier=Mouser; ComponentLink3URL: http://www.diodes.com///datasheets/ds30407.pdf?src-supplier=Avnet; ComponentLink3Description: http://www.diodes.com///datasheets/ds30407.pdf?src-supplier=Avnet; ComponentLink4URL: http://www.diodes.com//datasheets/ds30407.pdf?src-supplier=Avnet; ComponentLink4Description: http://www.diodes.com//datasheets/ds30407.pdf?src-supplier=Avnet; ComponentLink5URL: https://datasheet.octopart.com/DDZ5V1B-7-Diodes-Inc.-datasheet-160462869.pdf?src-supplier=Farnell; ComponentLink5Description: https://datasheet.octopart.com/DDZ5V1B-7-Diodes-Inc.-datasheet-160462869.pdf?src-supplier=Farnell; ComponentLink6URL: http://www.diodes.com/_files/datasheets/ds30407.pdf?src-supplier=Future+Electronics; ComponentLink6Description: http://www.diodes.com/_files/datasheets/ds30407.pdf?src-supplier=Future+Electronics; ComponentLink7URL: https://www.diodes.com/assets/Datasheets/Ds30407.pdf?src-supplier=Digikey; ComponentLink7Description: https://www.diodes.com/assets/Datasheets/Ds30407.pdf?src-supplier=Digikey; ComponentLink8URL: https://datasheet.octopart.com/DDZ5V1B-7-Diodes-Inc.-datasheet-22952792.pdf?src-supplier=Future+Electronics; ComponentLink8Description: https://datasheet.octopart.com/DDZ5V1B-7-Diodes-Inc.-datasheet-22952792.pdf?src-supplier=Future+Electronics; ComponentLink9URL: https://www.verical.com/server-webapp/html/getDatasheet?partID=95733&src-supplier=Verical; ComponentLink9Description: https://www.verical.com/server-webapp/html/getDatasheet?partID=95733&src-supplier=Verical; Supplier 1: Digikey; Supplier Part Number 1: DDZ5V1BDICT-ND; Manufacturer Part Number: DDZ5V1B-7; RoHS: Yes; Category: Zener Diodes; Stock 1: 88257; Pricing 1: 1=0,25, 10=0,172, 100=0,084, 500=0,07006, 1000=0,04868 (USD); Supplier 2: Mouser; Supplier Part Number 2: 621-DDZ5V1B-7; Stock 2: 108934; Pricing 2: 1=0,24, 10=0,161, 50=0,161, 100=0,084, 1000=0,048, 10000=0,028 (USD); Value: 3V9
F1 F2 = F_?_0805: (Generico) Fuse SMD 0805; Origin: TAIWAN; Published: 8-Jun-2000; LatestRevisionDate: 17-Jul-2002; LatestRevisionNote: Re-released for DXP Platform.; PackageReference: PIN-W2/E2.8; Publisher: Altium Limited; PackageDescription: Thru-Hole; 2 Leads; Supplier 1: Digi-Key; Supplier Part Number 1: SF-1206S200-2CT-ND
  F1: Value: 1A
  F2: Value: 0
L2 = L_?_5: (Generico)  Inductor SMD 10x10; Value: 0
P4 = P_Header 3: Header, 3-Pin; Value: Header 3
Q1 = Q_SQ2389CES-T1_GE3: Value: SQ2389CES-T1_GE3; Supplier 1: Mouser; Supplier Part Number 1: 78-SQ2389CES-T1_GE3
Q2 = Q_BC856: TRANS PNP 65V 0.1A SOT23; Manufacturer: ON Semiconductor; Max Power Dissipation: 300mW; Max Collector Current: 100mA; Transition Frequency: 100MHz; Emitter Base Voltage (VEBO): 5V; Collector Base Voltage (VCBO): 80V; Collector Emitter Saturation Voltage: -650mV; Collector-emitter Voltage-Max: 650mV; hFE Min: 125; Number of Elements: 1; Voltage Rating (DC): -65V; Current Rating: -100mA; ComponentLink1Description: Manufacturer Link; ComponentLink1URL: http://www.fairchildsemi.com/; ComponentLink2Description: Datasheet; ComponentLink2URL: http://www.fairchildsemi.com/ds/2N%2F2N3904.pdf; Case/Package: SOT-23-3; Pins: 3; Contact Plating: Tin,Matte; Min Operating Temperature: -55°C; Max Operating Temperature: 150°C; Package Quantity: 3000; Packaging: Tape and Reel; Collector Emitter Breakdown Voltage: 65V; Polarity: PNP; Clock Frequency: 100MHz; Gain Bandwidth Product: 100MHz; Series: -; Collector Emitter Voltage (VCEO): 65V; Frequency: 100MHz; Max Breakdown Voltage: 65V; Power Dissipation: 300mW; Length: 2.9mm; Width: 1.3mm; Height: 0.94mm; Radiation Hardening: No; Lead Free: Lead Free; RoHS Compliant: Yes; Reach SVHC Compliant: No; ComponentLink3URL: http://www.farnell.com/datasheets/1840529.pdf?src-supplier=Farnell; ComponentLink3Description: http://www.farnell.com/datasheets/1840529.pdf?src-supplier=Farnell; ComponentLink4URL: http://www.alliedelec.com/m/d/ae2fff4c1f3549b23e4cd9e6cc054b51.pdf?src-supplier=Allied+Electronics; ComponentLink4Description: http://www.alliedelec.com/m/d/ae2fff4c1f3549b23e4cd9e6cc054b51.pdf?src-supplier=Allied+Electronics; ComponentLink5URL: http://www.mouser.com/ds/2/308/BC856ALT1-D-249456.pdf?src-supplier=Mouser; ComponentLink5Description: http://www.mouser.com/ds/2/308/BC856ALT1-D-249456.pdf?src-supplier=Mouser; ComponentLink6URL: http://www.farnell.com/datasheets/1840529.pdf?src-supplier=Element14; ComponentLink6Description: http://www.farnell.com/datasheets/1840529.pdf?src-supplier=Element14; ComponentLink7URL: http://www.farnell.com/datasheets/1840529.pdf?src-supplier=Newark; ComponentLink7Description: http://www.farnell.com/datasheets/1840529.pdf?src-supplier=Newark; Supplier Part Number 1: 863-BC856ALT1G; Manufacturer Part Number: BC856ALT1G; RoHS: Yes; Category: BJTs; Stock 1: 30566; Pricing 1: 1=0,11, 10=0,071, 50=0,071, 100=0,034, 1000=0,021, 10000=0,015 (USD); Value: BC856ALT1G; Supplier 1: Mouser
R18 = R_10k_b: as R3 on sheet Banks; Case/Package: 0805; Case Code (Metric): 2012; Case Code (Imperial): 0805; Min Operating Temperature: -55°C; Max Operating Temperature: 155°C; Packaging: Tape and Reel; Package Quantity: 1; Number of Terminations: 2; Termination: SMD/SMT; Max Power Dissipation: 125mW; Features: Moisture Resistant,Automotive AEC-Q200,Anti-Sulfur; Series: AC; Construction: Rectangular; Length: 0.079inch; Width: 0.049inch; Height: 0.024inch; Depth: 1.25mm; Military Standard: Not; Lead Free: Lead Free; RoHS Compliant: Yes; ComponentLink1URL: http://www.yageo.com/NewPortal/yageodocoutput?fileName=/pdf/R-Chip/PYu-AC_51_RoHS_L_6.pdf&src-supplier=Digikey; ComponentLink1Description: http://www.yageo.com/NewPortal/yageodocoutput?fileName=/pdf/R-Chip/PYu-AC_51_RoHS_L_6.pdf&src-supplier=Digikey; ComponentLink2URL: http://www.yageo.com/documents/recent/PYu-AC_51_RoHS_L_2_revised.pdf?src-supplier=Future+Electronics; ComponentLink2Description: http://www.yageo.com/documents/recent/PYu-AC_51_RoHS_L_2_revised.pdf?src-supplier=Future+Electronics; ComponentLink3URL: http://www.yageo.com/NewPortal/yageodocoutput?fileName=/pdf/R-Chip/PYu-AC_51_RoHS_L_6.pdf&src-supplier=NAC+Semi; ComponentLink3Description: http://www.yageo.com/NewPortal/yageodocoutput?fileName=/pdf/R-Chip/PYu-AC_51_RoHS_L_6.pdf&src-supplier=NAC+Semi; ComponentLink4URL: http://www.yageo.com/NewPortal/yageodocoutput?fileName=/pdf/R-Chip/PYu-AC_51_RoHS_L_6.pdf&src-supplier=Rutronik; ComponentLink4Description: http://www.yageo.com/NewPortal/yageodocoutput?fileName=/pdf/R-Chip/PYu-AC_51_RoHS_L_6.pdf&src-supplier=Rutronik; Supplier 1: Digikey; Supplier Part Number 1: 311-10KLGCT-ND; RoHS: Yes; Category: Chip SMD Resistors; Stock 1: 480247; Pricing 1: 1=0,1, 10=0,031, 50=0,0198, 100=0,0166, 500=0,01152, 1000=0,00997 (USD); Value: 10k
R19 = R_2k2_b: Resistor SMD 0805; Manufacturer: Bourns; Manufacturer Part Number: CR0805-FX-2201ELF; Voltage Rating: 150V; Tolerance: 1%; Power Rating: 125mW; Temperature Coefficient: 100ppm/°C; Mounting Technology: Surface Mount; Case/Package: 0805; Contact Plating: Tin; Case Code (Imperial): 0805; Case Code (Metric): 2012; Min Operating Temperature: -55°C; Max Operating Temperature: 155°C; Packaging: Tape and Reel; Package Quantity: 5000; Termination: SMD/SMT; Series: CR0805; Resistor Type: Thick Film; Voltage Rating (DC): 150V; Resistance Tolerance: 1%; Length: 2mm; Width: 1.25mm; Height: 0.5mm; Thickness: 508um; Radiation Hardening: No; RoHS Compliant: Yes; Reach SVHC Compliant: No; ComponentLink1URL: https://datasheet.ciiva.com/22713/691949-22713256.pdf?src-supplier=Element14; ComponentLink1Description: https://datasheet.ciiva.com/22713/691949-22713256.pdf?src-supplier=Element14; ComponentLink2URL: https://datasheet.ciiva.com/5541/chpreztr-5541000.pdf?src-supplier=Mouser; ComponentLink2Description: https://datasheet.ciiva.com/5541/chpreztr-5541000.pdf?src-supplier=Mouser; Supplier 1: Digikey; Supplier Part Number 1: 118-CR0805-FX-2201ELFCT-ND; RoHS: Yes; Category: Chip SMD Resistors; Stock 1: 80126; Pricing 1: 1=0,1, 10=0,021, 50=0,0132, 100=0,011, 500=0,00744, 1000=0,00639 (USD); Value: 2k2
TP1 TP2 = P_T_TP: Test Point SMD; Origin: CHINA; Published: 8-Jun-2000; LatestRevisionDate: 17-Jul-2002; LatestRevisionNote: Re-released for DXP Platform.; PackageReference: AXIAL-0.3; Publisher: Altium Limited; PackageDescription: Axial Device, Thru-Hole; 2 Leads; 0.3 in Pin Spacing; Supplier 1: Mouser; Supplier Part Number 1: 279-RCT-0C; Type: CONNECTOR; Value: SMD Test Point
U1 = U_LM2576-3.3WU: Value: LM2576T-5; Supplier 1: Mouser; Supplier Part Number 1: 998-LM2576-3.3WUTR
U2 = U_LDL1117: LDL1117 Series 1.2 A 2.5 V High PSRR LDO Linear Voltage Regulator-SOT-223; Manufacturer: STMicroelectronics; Manufacturer Part Number: LDL1117S25R; Output Type: Fixed; Output Configuration: Positive; Number of Regulators: 1; Max Supply Voltage: 18V; Min Output Voltage: 2.5V; Output Current: 1.2A; Quiescent Current: 500uA; Power Supply Rejection Ratio (PSRR): 65dB; Accuracy: 2%; Min Supply Voltage: 2.6V; Nominal Supply Current: 250uA; Number of Channels: 1NUMBER; Value: LDL1117S25R; Mounting Technology: Surface Mount; Case/Package: TO-261-4; Min Operating Temperature: -40°C; Max Operating Temperature: 125°C; Packaging: Cut Tape; Series: -; Number of Outputs: 1NUMBER; Output Voltage: 2.5V; Height: 1.8mm; RoHS Compliant: Yes; ComponentLink1URL: http://www.farnell.com/datasheets/2342741.pdf?src-supplier=Farnell; ComponentLink1Description: http://www.farnell.com/datasheets/2342741.pdf?src-supplier=Farnell; ComponentLink2URL: http://www.st.com/content/ccc/resource/technical/document/datasheet/group3/0e/5a/00/ca/10/1a/4f/a5/DM00366442/files/DM00366442.pdf/jcr:content/translations/en.DM00366442.pdf?src-supplier=Digikey; ComponentLink2Description: http://www.st.com/content/ccc/resource/technical/document/datasheet/group3/0e/5a/00/ca/10/1a/4f/a5/DM00366442/files/DM00366442.pdf/jcr:content/translations/en.DM00366442.pdf?src-supplier=Digikey; ComponentLink3URL: https://datasheet.octopart.com/LDL1117S25R-STMicroelectronics-datasheet-165583407.pdf?src-supplier=TME; ComponentLink3Description: https://datasheet.octopart.com/LDL1117S25R-STMicroelectronics-datasheet-165583407.pdf?src-supplier=TME; Supplier 1: Mouser; Supplier Part Number 1: 511-LDL1117S25R; RoHS: Yes; Category: Voltage Regulators - Linear; Stock 1: 10345; Pricing 1: 1=1,1, 10=0,98, 50=0,935, 100=0,757, 1000=0,478, 10000=0,415 (USD)

## Nets that join several sheets
3V3: Banks (R1.2 R4.2), Sensor (L1.1 R16.2 R17.2), Power (6 pins)
GND: Banks (C8.1 C9.1 D2.1 S1.2), Sensor (14 pins), Power (17 pins)
NetC45_2: Banks (U7.24), Sensor (C45.2 R14.1 U10.10)
NetR13_2: Banks (U7.21), Sensor (R13.2)
NetR16_1: Banks (U7.7), Sensor (R16.1 U10.46)
NetR17_1: Banks (U7.8), Sensor (R17.1 U10.45)
NetU7_9: Banks (U7.9), Sensor (U10.41)
NetU7_10: Banks (U7.10), Sensor (U10.40)
NetU7_11: Banks (U7.11), Sensor (U10.36)
NetU7_12: Banks (U7.12), Sensor (U10.35)
NetU7_15: Banks (U7.15), Sensor (U10.34)
NetU7_16: Banks (U7.16), Sensor (U10.33)
NetU7_17: Banks (U7.17), Sensor (U10.32)
NetU7_18: Banks (U7.18), Sensor (U10.28)
NetU7_19: Banks (U7.19), Sensor (U10.27)
NetU7_20: Banks (U7.20), Sensor (U10.31)
NetU7_22: Banks (U7.22), Sensor (U10.26)
NetU7_23: Banks (U7.23), Sensor (U10.8)